# EAGLE design base (EAGLE 9.3.2)

## Sheet 1 of 4
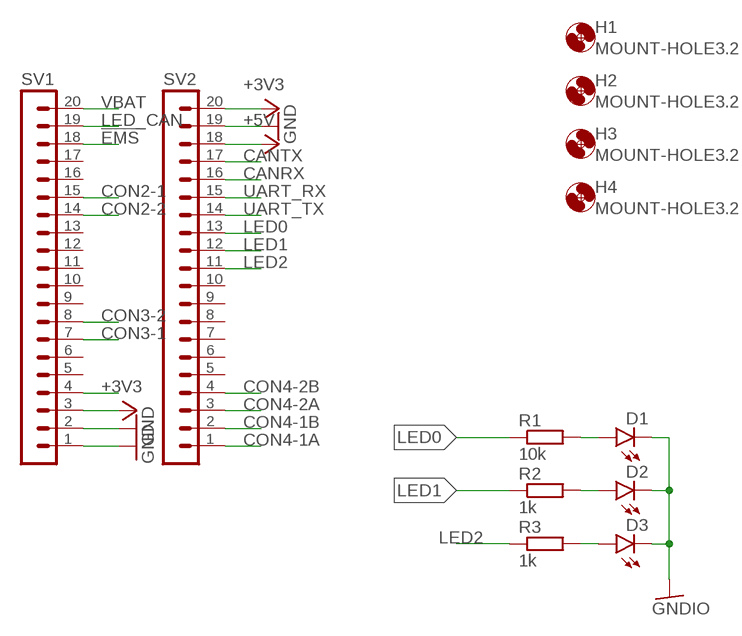
[diagram p0: schematic, sheet 1]

### Parts
D1  LEDCHIPLED_0805  [CHIPLED_0805]
D2  LEDCHIPLED_0805  [CHIPLED_0805]
D3  LEDCHIPLED_0805  [CHIPLED_0805]
H1  MOUNT-HOLE3.2  [3,2]
H2  MOUNT-HOLE3.2  [3,2]
H3  MOUNT-HOLE3.2  [3,2]
H4  MOUNT-HOLE3.2  [3,2]
R1  10k  R-EU_R0603  [R0603]
R2  1k  R-EU_R0603  [R0603]
R3  1k  R-EU_R0603  [R0603]
SV1  MA20-1L  [MA20-1L]
SV2  MA20-1L  [MA20-1L]

### Nets
!EMS: SV1.18 ; also sheet 2
+3V3: SV1.3 SV2.20 ; also sheet 3,4
+5V: SV2.18 ; also sheet 2,3,4
CANRX: SV2.16 ; also sheet 2
CANTX: SV2.17 ; also sheet 2
CON2-1: SV1.15 ; also sheet 4
CON2-2: SV1.14 ; also sheet 4
CON3-1: SV1.7 ; also sheet 4
CON3-2: SV1.8 ; also sheet 4
CON4-1A: SV2.1 ; also sheet 4
CON4-1B: SV2.2 ; also sheet 4
CON4-2A: SV2.3 ; also sheet 4
CON4-2B: SV2.4 ; also sheet 4
GND: D1.C D2.C D3.C SV1.1 SV1.2 SV2.19 ; supply symbol labelled GNDIO ; also sheet 2,3,4
LED0: R1.1 SV2.13
LED1: R2.1 SV2.12
LED2: R3.1 SV2.11
LED_CAN: SV1.19 ; also sheet 2
N$3: D2.A R2.2
N$7: D1.A R1.2
N$10: D3.A R3.2
N$33: SV1.4
UART_RX: SV2.15
UART_TX: SV2.14
VBAT: SV1.20
Unconnected: SV1.5 SV1.6 SV1.9 SV1.10 SV1.11 SV1.12 SV1.13 SV1.16 SV1.17 SV2.5 SV2.6 SV2.7 SV2.8 SV2.9 SV2.10

## Sheet 2 of 4
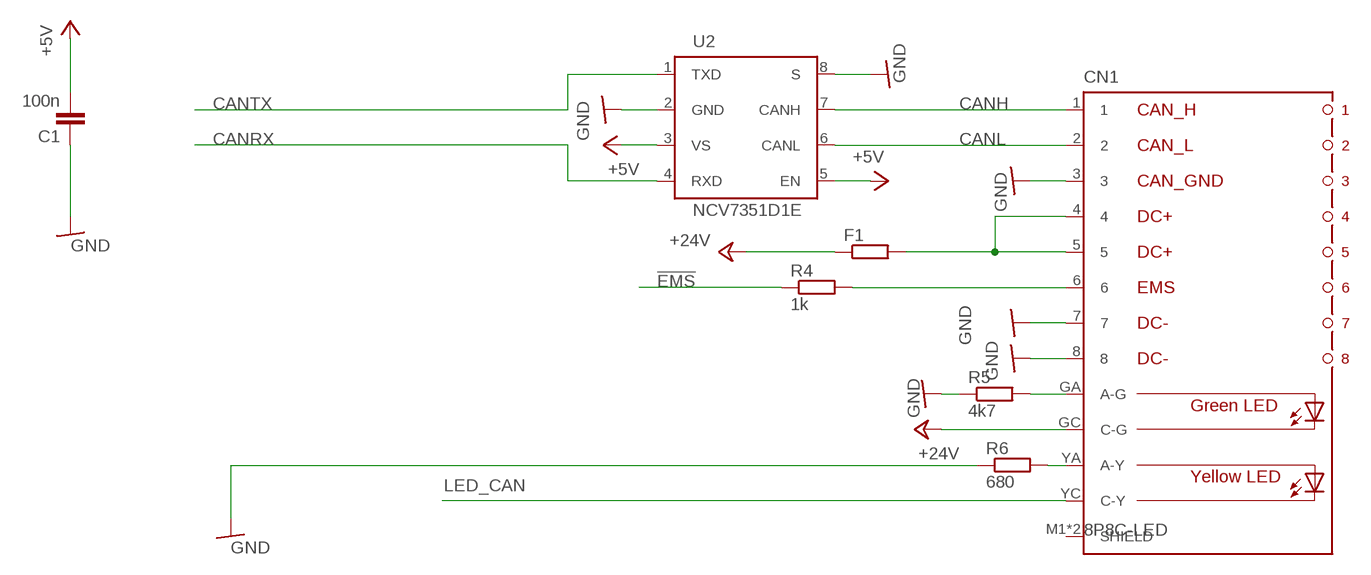
[diagram p1: schematic, sheet 2]

### Parts
C1  100n  C-EUC0603  [C0603]
CN1  8P8C-LED  [8P8C-LED]
F1  R-EU_R1206  [R1206]
R4  1k  R-EU_R0603  [R0603]
R5  4k7  R-EU_R0603  [R0603]
R6  680  R-EU_R0603  [R0603]
U2  NCV7351D1E  [SO08]

### Nets
!EMS: R4.1 ; also sheet 1
!EMS_ISO: CN1.6 R4.2
+5V: C1.2 U2.3(VS) U2.5(EN) ; also sheet 1,3,4
+24V: CN1.GC(C-G) F1.1 ; also sheet 3
CANH: CN1.1 U2.7(CANH)
CANL: CN1.2 U2.6(CANL)
CANRX: U2.4(RXD) ; also sheet 1
CANTX: U2.1(TXD) ; also sheet 1
GND: C1.1 CN1.3 CN1.7 CN1.8 R5.1 R6.1 U2.2(GND) U2.8(S) ; supply symbol labelled GNDIO ; also sheet 1,3,4
LED_CAN: CN1.YC(C-Y) ; also sheet 1
N$6: CN1.GA(A-G) R5.2
N$12: CN1.YA(A-Y) R6.2
N$36: CN1.4 CN1.5 F1.2
Unconnected: CN1.M1(SHIELD) CN1.M2(SHIELD)

## Sheet 3 of 4
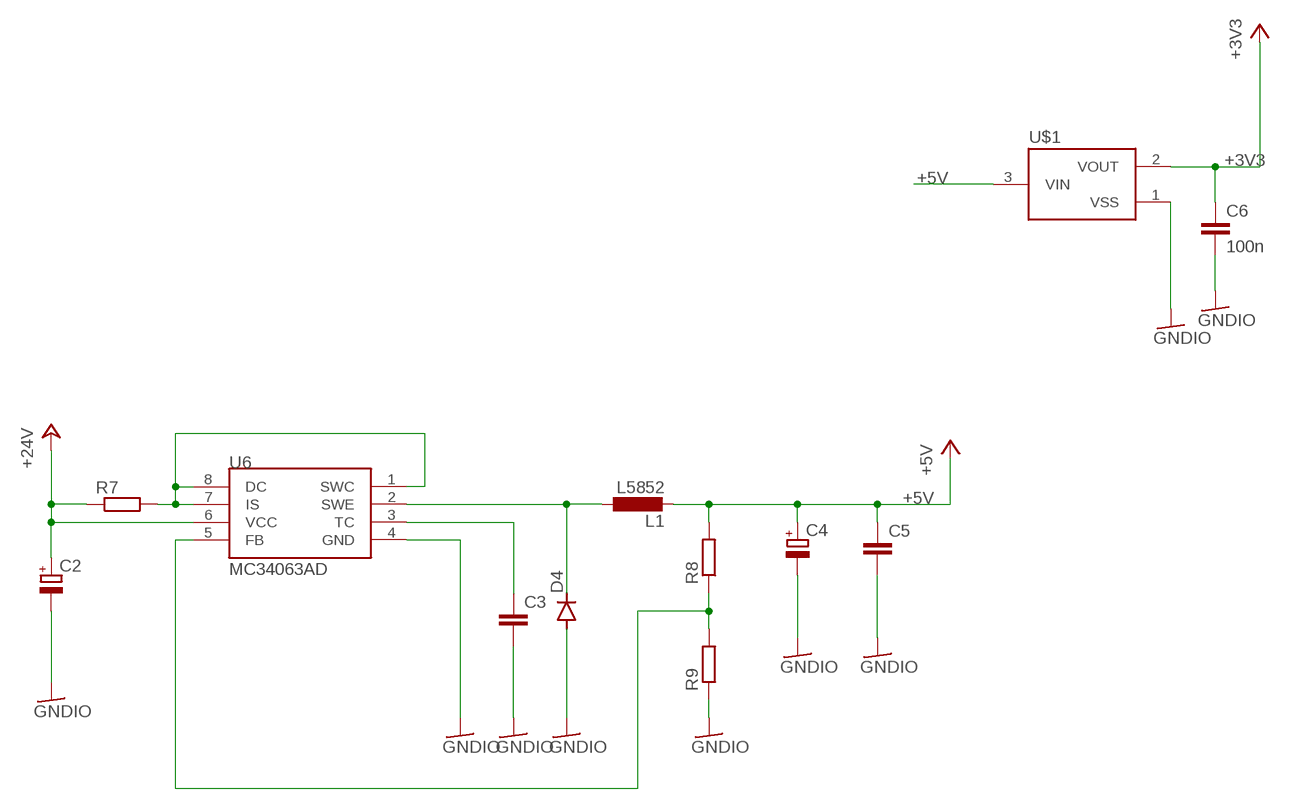
[diagram p2: schematic, sheet 3]

### Parts
C2  CPOL-EUE2-5  [E2-5]
C3  C-EUC0603  [C0603]
C4  CPOL-EUE2-5  [E2-5]
C5  C-EUC0603  [C0603]
C6  100n  C-EUC0603  [C0603]
D4  DIODE-SOD123  [SOD123]
L1  L5852  [L5852]
R7  R-EU_R1206  [R1206]
R8  R-EU_R0603  [R0603]
R9  R-EU_R0603  [R0603]
U6  MC34063AD  [SOIC8]
U$1  XC6206  [SOT95P240X110-3]

### Nets
+3V3: C6.1 U$1.2(VOUT) ; also sheet 1,4
+5V: C4.+ C5.1 L1.P$2 R8.2 U$1.3(VIN) ; also sheet 1,2,4
+24V: C2.+ R7.1 U6.6(VCC) ; also sheet 2
GND: C2.- C3.2 C4.- C5.2 C6.2 D4.A R9.1 U6.4(GND) U$1.1(VSS) ; supply symbol labelled GNDIO ; also sheet 1,2,4
N$58: R7.2 U6.1(SWC) U6.7(IS) U6.8(DC)
N$59: D4.C L1.P$1 U6.2(SWE)
N$60: C3.1 U6.3(TC)
N$61: R8.1 R9.2 U6.5(FB)

## Sheet 4 of 4
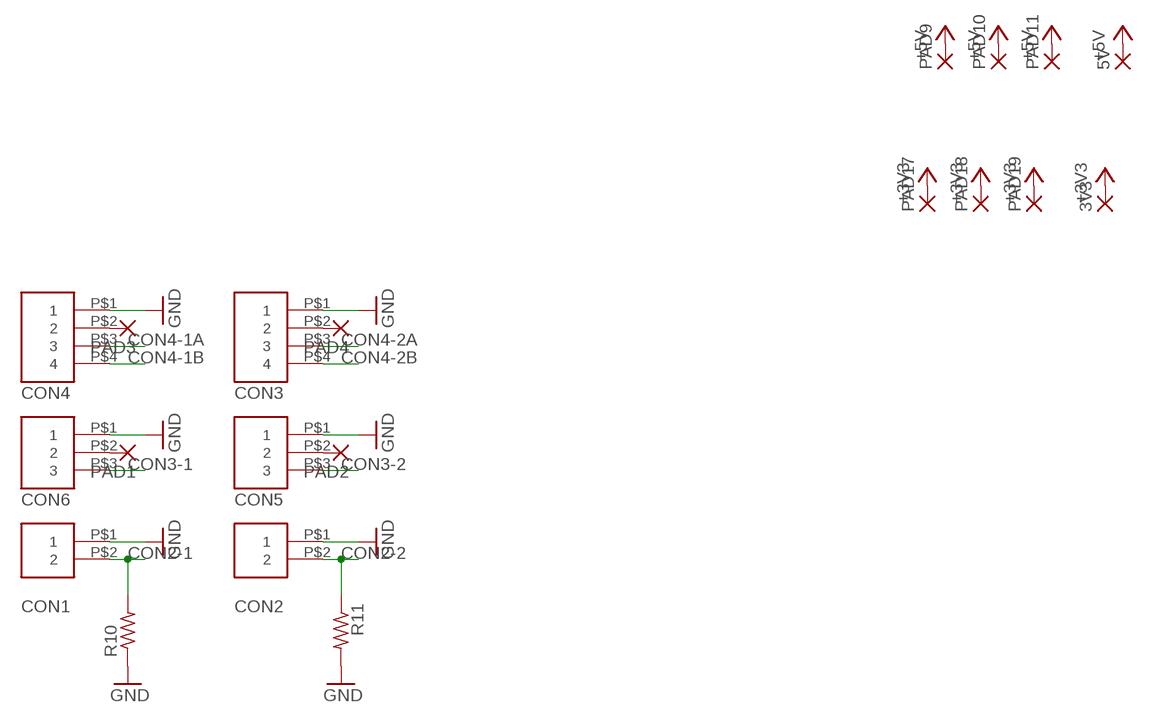
[diagram p3: schematic, sheet 4]

### Parts
3V3  SMD2  [SMD1,27-2,54]
5V  SMD2  [SMD1,27-2,54]
CON1  XH-2-SIDE  [CON-XH-2-SIDE]
CON2  XH-2-SIDE  [CON-XH-2-SIDE]
CON3  XH-4-SIDE  [CON-XH-4-SIDE]
CON4  XH-4-SIDE  [CON-XH-4-SIDE]
CON5  XH-3-SIDE  [CON-XH-3-SIDE]
CON6  XH-3-SIDE  [CON-XH-3-SIDE]
PAD1  SMD2  [SMD1,27-2,54]
PAD2  SMD2  [SMD1,27-2,54]
PAD3  SMD2  [SMD1,27-2,54]
PAD4  SMD2  [SMD1,27-2,54]
PAD9  SMD2  [SMD1,27-2,54]
PAD10  SMD2  [SMD1,27-2,54]
PAD11  SMD2  [SMD1,27-2,54]
PAD17  SMD2  [SMD1,27-2,54]
PAD18  SMD2  [SMD1,27-2,54]
PAD19  SMD2  [SMD1,27-2,54]
R10  R-US_R0603  [R0603]
R11  R-US_R0603  [R0603]

### Nets
+3V3: 3V3.1(P) PAD17.1(P) PAD18.1(P) PAD19.1(P) ; also sheet 1,3
+5V: 5V.1(P) PAD9.1(P) PAD10.1(P) PAD11.1(P) ; also sheet 1,2,3
CON2-1: CON1.P$2 R10.2 ; also sheet 1
CON2-2: CON2.P$2 R11.1 ; also sheet 1
CON3-1: CON6.P$3 ; also sheet 1
CON3-2: CON5.P$3 ; also sheet 1
CON4-1A: CON4.P$3 ; also sheet 1
CON4-1B: CON4.P$4 ; also sheet 1
CON4-2A: CON3.P$3 ; also sheet 1
CON4-2B: CON3.P$4 ; also sheet 1
GND: CON1.P$1 CON2.P$1 CON3.P$1 CON4.P$1 CON5.P$1 CON6.P$1 R10.1 R11.2 ; also sheet 1,2,3
N$1: CON3.P$2 PAD4.1(P)
N$2: CON5.P$2 PAD2.1(P)
N$4: CON4.P$2 PAD3.1(P)
N$11: CON6.P$2 PAD1.1(P)

## Library data of the parts
3V3 5V PAD1-PAD4 PAD9-PAD11 PAD17-PAD19 = wirepad:SMD2: SMD PAD
C1 C5 C6 = rcl:C-EU: CAPACITOR, European symbol
C2 C4 = rcl:CPOL-EU: POLARIZED CAPACITOR, European symbol
C3 = rcl:C-EU: CAPACITOR, European symbol; SPICEPREFIX: C
CN1 = con-rj45:8P8C-LED: generic 8P8C connector with two LED's; OC_FARNELL: unknown; OC_NEWARK: unknown
CON1 CON2 = con-xh:XH-2-SIDE
CON3 CON4 = con-xh:XH-4-SIDE
CON5 CON6 = con-xh:XH-3-SIDE
D1-D3 = led:LED: LED OSRAM: - CHIPLED LG R971, LG N971, LY N971, LG Q971, LY Q971, LO R971, LY R971 LH N974, LH R974 LS Q976, LO Q976, LY Q976 LO Q996 - Hyper CHIPLED LW Q18S LB Q993, LB Q99A, LB R99A - SideLED LS A670, LO A670, LY A670, LG A670, LP A670 LB A673, LV A673, LT A673, LW A673 LH A674 LY A675 LS A676, LA A676, LO A676, LY A676, LW A676 LS A679, LY A679, LG A679 - Hyper Micro SIDELED® LS Y876, LA Y876, LO Y876, LY Y876 LT Y87S - SmartLED LW L88C, LW L88S LB L89C, LB L89S, LG L890 LS L89K, LO L89K, LY L89K LS L896, LA L896, LO L896, LY L896 - TOPLED LS T670, LO T670, LY T670, LG T670, LP T670 LSG T670, LSP T670, LSY T670, LOP T670, LYG T670 LG T671, LOG T671, LSG T671 LB T673, LV T673, LT T673, LW T673 LH T674 LS T676, LA T676, LO T676, LY T676, LB T676, LH T676, LSB T676, LW T676 LB T67C, LV T67C, LT T67C, LS T67K, LO T67K, LY T67K, LW E67C LS E67B, LA E67B, LO E67B, LY E67B, LB E67C, LV E67C, LT E67C LW T67C LS T679, LY T679, LG T679 LS T770, LO T770, LY T770, LG T770, LP T770 LB T773, LV T773, LT T773, LW T773 LH T774 LS E675, LA E675, LY E675, LS T675 LS T776, LA T776, LO T776, LY T776, LB T776 LHGB T686 LT T68C, LB T68C - Hyper Mini TOPLED® LB M676 - Mini TOPLED Santana® LG M470 LS M47K, LO M47K, LY M47K Source: http://www.osram.convergy.de LUXEON: - LUMILED® LXK2-PW12-R00, LXK2-PW12-S00, LXK2-PW14-U00, LXK2-PW14-V00 LXK2-PM12-R00, LXK2-PM12-S00, LXK2-PM14-U00 LXK2-PE12-Q00, LXK2-PE12-R00, LXK2-PE12-S00, LXK2-PE14-T00, LXK2-PE14-U00 LXK2-PB12-K00, LXK2-PB12-L00, LXK2-PB12-M00, LXK2-PB14-N00, LXK2-PB14-P00, LXK2-PB14-Q00 LXK2-PR12-L00, LXK2-PR12-M00, LXK2-PR14-Q00, LXK2-PR14-R00 LXK2-PD12-Q00, LXK2-PD12-R00, LXK2-PD12-S00 LXK2-PH12-R00, LXK2-PH12-S00 LXK2-PL12-P00, LXK2-PL12-Q00, LXK2-PL12-R00 Source: www.luxeon.com KINGBRIGHT: KA-3528ASYC Source: www.kingbright.com
D4 = diode:DIODE-: DIODE
F1 R4-R9 = rcl:R-EU_: RESISTOR, European symbol; SPICEPREFIX: R
H1-H4 = holes:MOUNT-HOLE: MOUNTING HOLE with drill center marker
L1 = l_ysk:L5852
R1-R3 = rcl:R-EU_: RESISTOR, European symbol
R10 R11 = rcl:R-US_: RESISTOR, American symbol; SPICEPREFIX: R
SV1 SV2 = con-lstb:MA20-1L: PIN HEADER; OC_FARNELL: unknown; OC_NEWARK: unknown
U2 = on-semi:NCV7351D1E: High Speed CAN Transceiver Source: NCV7351-D.PDF <http://www.onsemi.com/PowerSolutions/document/NCV7351-D.PDF>
U6 = mc34063:MC34063
U$1 = torex:XC6206

## Board
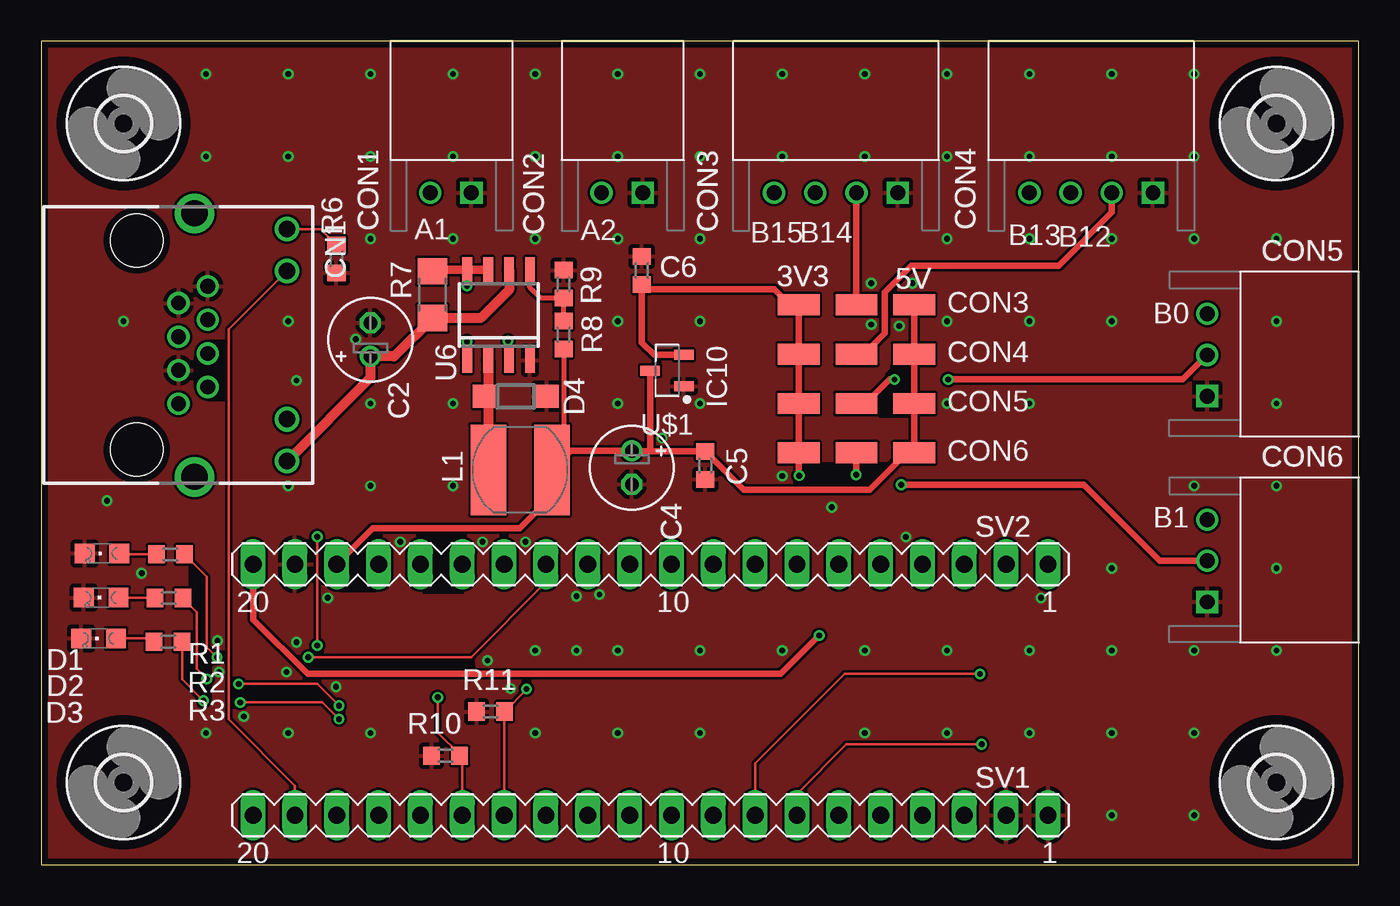
[diagram p4: board, top side]
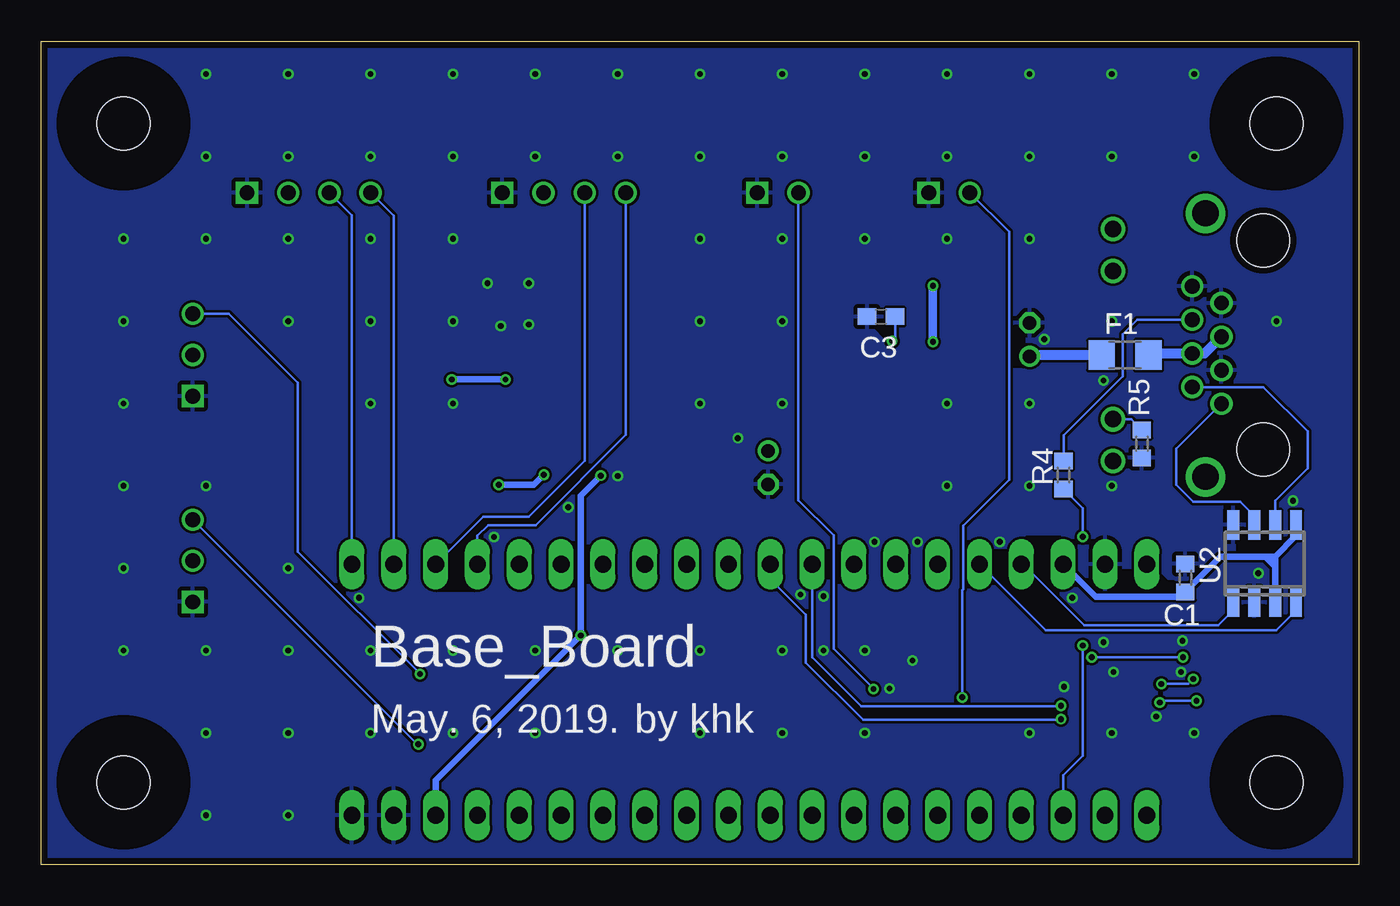
[diagram p5: board, bottom side, seen from below]

Size 80 x 50 mm. Coordinates in mm from the lower left corner, seen from the top.
Outline: 0,0 80,0 80,50 0,50 0,0
Copper layers (1*16): Top 0.035mm / dielectric 1.5mm / Bottom 0.035mm
Design rules "seeed_2layers": minimum track width 6mil, minimum drill 0.2mm, track to track 6mil, track to pad 6mil, pad to pad 6mil, via to via 6mil, smd to smd 0mil, copper to edge 0.4mm, drill to drill 12mil, minimum pad ring 0.15mm, minimum via ring 0.15mm, stop-mask expansion 4mil, vias tented up to drill 50mil, thermal gap 10mil

### Footprints (pad centres in the part's own frame; a part is rotated, then mirrored left to right if it is on the bottom)
SMD1,27-2,54 = smd 1.27 x 2.54: 1 0,0
C0603 = smd 1 x 1.1: 1 -0.85,0; 2 0.85,0
E2-5 = drill 0.813 pad 1.27: + -1.016,0 | drill 0.813 pad 1.27 octagon: - 1.016,0
C0603' = smd 1.1 x 1: 1 -0.85,0; 2 0.85,0
8P8C-LED = drill 0.9 pad 1.3: 1 3.57,-3.81; 2 2.55,-2.03; 3 1.53,-3.81; 4 0.51,-2.03; 5 -0.51,-3.81; 6 -1.53,-2.03; 7 -2.55,-3.81; 8 -3.57,-2.03 | drill 1 pad 1.422: GA 4.5,2.78; GC 7.04,2.78; YA -7.04,2.78; YC -4.5,2.78 | drill 1.6 pad 2.184: M1 -8,-2.85; M2 8,-2.85 | hole 3.2: 6.35,-6.35; -6.35,-6.35
CON-XH-2-SIDE = drill 0.9 square: P$1 4.92,2.3 | drill 0.9: P$2 2.42,2.3
CON-XH-4-SIDE = drill 0.9 square: P$1 10,2.3 | drill 0.9: P$2 7.5,2.3; P$3 5,2.3; P$4 2.5,2.3
CON-XH-3-SIDE = drill 0.9 square: P$1 7.55,2.3 | drill 0.9: P$2 5.05,2.3; P$3 2.55,2.3
CHIPLED_0805 = smd 1.2 x 1.2: A 0,-1.05; C 0,1.05
SOD123 = smd 1.4 x 1.4: A 1.9,0; C -1.9,0
R1206 = smd 1.6 x 1.803: 1 -1.422,0; 2 1.422,0
3,2 = hole 3.2: 0,0
L5852 = smd 2.15 x 5.5: P$1 1.925,0; P$2 -1.925,0
R0603 = smd 1 x 1.1: 1 -0.85,0; 2 0.85,0
MA20-1L = drill 1.016 long: 1 24.13,0; 2 21.59,0; 3 19.05,0; 4 16.51,0; 5 13.97,0; 6 11.43,0; 7 8.89,0; 8 6.35,0; 9 3.81,0; 10 1.27,0; 11 -1.27,0; 12 -3.81,0; 13 -6.35,0; 14 -8.89,0; 15 -11.43,0; 16 -13.97,0; 17 -16.51,0; 18 -19.05,0; 19 -21.59,0; 20 -24.13,0
SO08 = smd 0.72 x 1.78: 1 -1.905,-2.35; 2 -0.635,-2.35; 3 0.635,-2.35; 4 1.905,-2.35; 5 1.905,2.35; 6 0.635,2.35; 7 -0.635,2.35; 8 -1.905,2.35
SOIC8 = smd 0.6 x 1.5: 1 -1.905,-2.75; 2 -0.635,-2.75; 3 0.635,-2.75; 4 1.905,-2.75; 5 1.905,2.75; 6 0.635,2.75; 7 -0.635,2.75; 8 -1.905,2.75
SOT95P240X110-3 = smd 1.18 x 0.609: 1 -1.024,0.95; 2 -1.024,-0.95; 3 1.024,0

### Placement (x,y rotation side)
3V3  46,34 270 top
5V  53,34 270 top
C1  10.53,17.42 270 bottom
C2  19.99,31.88 90 top
C3  [C0603']  29.01,33.28 180 bottom
C4  35.86,24.11 270 top
C5  40.32,24.24 270 top
C6  36.47,36.08 90 top
CN1  12.15,31.55 270 top
CON1  21.2,38.5 0 top
CON2  31.6,38.5 0 top
CON3  42,38.5 0 top
CON4  57.5,38.5 0 top
CON5  68.5,36 270 top
CON6  68.5,23.5 270 top
D1  3.69,18.9 90 top
D2  3.64,16.22 90 top
D3  3.49,13.74 90 top
D4  28.81,28.44 0 top
F1  14.19,30.94 0 bottom
H1  5,5 0 top
H2  75,5 0 top
H3  5,45 0 top
H4  75,45 0 top
L1  29.08,23.97 180 top
PAD1  49.5,25 270 top
PAD2  49.5,28 270 top
PAD3  49.5,31 270 top
PAD4  49.5,34 270 top
PAD9  53,25 270 top
PAD10  53,28 270 top
PAD11  53,31 270 top
PAD17  46,25 270 top
PAD18  46,28 270 top
PAD19  46,31 270 top
R1  7.84,18.84 180 top
R2  7.75,16.19 180 top
R3  7.71,13.54 180 top
R4  17.93,23.66 90 bottom
R5  13.17,25.55 90 bottom
R6  17.93,36.78 90 top
R7  23.76,34.61 90 top
R8  31.72,32.17 270 top
R9  31.72,35.25 270 top
R10  24.56,6.61 0 top
R11  27.29,9.3 180 top
SV1  37,3 0 top
SV2  37,18.24 0 top
U2  5.72,18.28 0 bottom
U6  27.77,33.38 0 top
U$1  38,30 180 top

### Tracks (layer width: path | path; a pad name or v marks a point on that pad's centre or on a via)
!EMS  (via drill 0.35)
  Top 0.152: v16.76,19.91 v16.76,13.31
  Bottom 0.152: R4.1 16.76,21.64 v16.76,19.91 | v16.76,13.31 16.76,6.6 17.95,5.42 SV1.18
!EMS_ISO
  Bottom 0.152: R4.2 17.93,26.06 14.33,29.67 14.33,32.21 13.45,33.08 CN1.6
+3V3  (via drill 0.35)
  Top 0.406: v46.02,23.62 46,23.65 PAD17.1 PAD18.1 PAD19.1 3V3.1 45.45,34 44.5,34.95 36.75,34.95 C6.1 36.47,31.7 37.22,30.95 U$1.2 | SV2.20 12.87,14.89 16.18,11.58 44.91,11.58 v47.24,13.92
  Bottom 0.406: v46.02,23.62 47.24,22.4 v47.24,13.92 56.05,5.11 SV1.3
+5V
  Top 0.305: R8.2 31.72,25.38 31.8,25.3 31.8,24.77 L1.P$2
  Top 0.406: 5V.1 PAD11.1 PAD10.1 PAD9.1 52.43,25 52.12,24.69 52.12,24.59 50.29,22.76 42.65,22.76 C5.1 36.98,25.09 | 36.98,25.09 35.9,25.09 C4.+ 32.16,25.13 L1.P$2 31,22.37 29.06,20.42 20.13,20.42 SV2.18 | U$1.3 36.98,25.1 36.98,25.09
  Bottom 0.406: SV2.18 15.97,16.26 10.84,16.26 C1.2 8.41,18.69 5.7,18.69 | 5.08,18.69 3.81,19.96 U2.5 | 5.7,18.69 5.08,18.69 | 5.08,18.69 5.08,18.09 | 5.08,18.09 U2.3 | 5.08,18.09 5.7,18.69
+24V
  Top 0.61: U6.6 28.41,34.91 26.69,33.19 R7.1 21.44,30.86 C2.+ 19.99,29.57 CN1.GC
  Bottom 0.61: F1.1 19.91,30.94 C2.+
CANH
  Bottom 0.152: U2.7 6.36,21.19 7.21,22.05 10.06,22.05 11.07,23.06 11.07,25.25 CN1.1
CANL
  Bottom 0.152: U2.6 5.08,22.11 3.11,24.09 3.11,26.32 5.79,29 CN1.2
CANRX
  Bottom 0.152: U2.4 3.81,15.42 5.01,14.22 19.01,14.22 SV2.16
CANTX
  Bottom 0.152: U2.1 7.62,15.44 8.53,14.53 16.66,14.53 20.37,18.24 SV2.17
CON2-1  (via drill 0.35)
  Top 0.152: v24.08,10.16 24.08,8.03 25.41,6.7 R10.2 25.57,6.45 SV1.15
  Bottom 0.152: CON1.P$2 21.23,38.41 21.23,23.37 24.02,20.58 24.02,16.72 24.08,16.66 v24.08,10.16
CON2-2  (via drill 0.35)
  Top 0.152: SV1.14 28.11,9.27 R11.1 29.46,10.62 v29.46,10.67
  Bottom 0.152: CON2.P$2 34.02,22.13 31.89,20.01 31.89,13.1 v29.46,10.67
CON3-1  (via drill 0.35)
  Top 0.152: v57.1,7.32 48.88,7.32 45.89,4.32 SV1.7
  Bottom 0.152: CON6.P$3 57.16,7.32 v57.1,7.32
CON3-2  (via drill 0.35)
  Top 0.152: SV1.8 43.35,6.15 48.78,11.58 v57,11.58
  Bottom 0.152: v57,11.58 64.41,19 64.41,29.26 68.6,33.45 CON5.P$3
CON4-1A
  Bottom 0.152: SV2.1 61.13,39.43 CON4.P$3
CON4-1B
  Bottom 0.152: CON4.P$4 58.59,39.39 SV2.2
CON4-2A
  Bottom 0.152: CON3.P$3 47,24.53 50.39,21.13 53.16,21.13 SV2.3
CON4-2B
  Bottom 0.152: CON3.P$4 44.5,26.11 49.99,20.62 52.85,20.62 53.51,19.97 SV2.4
GND  (via drill 0.35)
  other vias: 10,48 15,48 10,43 15,43 30,48 35,48 30,43 35,43 20,48 25,48 20,43 25,43 40,48 45,48 40,43 45,43 50,48 50,43 55,48 60,48 55,43 60,43 65,48 65,43 70,48 70,43 5,33 15,33 20,38 25,38 30,38 35,38 35,33 35,28 25,28 20,28 40,28 40,33 40,38 55,38 55,33 60,33 60,38 65,38 65,33 55,28 60,28 70,38 75,38 75,28 75,33 75,23 70,23 75,18 75,13 25,23 20,23 15,23 30,13 35,13 40,13 45,13 50,13 55,13 60,13 65,13 65,18 70,13 70,8 70,3 65,3 65,8 60,8 55,8 50,8 40,8 35,8 30,8 20,8 15,8 10,8 28.5,10.7 14.9,11.7 10.7,13.6 10.8,11.7 15.5,13.5 21.8,19.6 26.8,19.6 29.4,19.6 52.9,35.3 52.1,32.7 50.4,32.8 45,23.6 50.4,35.3 37.7,25.9 12.3,9 27.1,12.4 17.9,10.8 6.1,17.7 4,22.1 17.4,16.2 19.1,31.9 15.5,29.4 48,21.7 52.5,19.9 33.9,16.4 32.5,16.3 32.5,13 60.7,16.2
  pour Top: 0,0 0,50 80,50 80,0
  pour Bottom: 0,0 0,50 80,50 80,0
  cutout Top: 51.6,30.3 51.6,30.1 51.3,29.8 51.3,28.9 50.9,28.5 50.9,27.2 51.8,27.2 52.7,27.2 52.7,30.3
  cutout Top: 47.4,24.4 51.4,24.4 51.6,24.6 51.6,24.3 50.3,23 46.3,23 46.3,24.4
  cutout Top: 9.3,30.8 9.3,29 10.1,28.2 11.2,28.2 11.2,31.8 10.3,31.8
  cutout Top: 9,18.1 9,16.9 9,16.1 9.9,15.2 9.9,17.5 9.4,18 9.3,18.1
  cutout Top: 10.6,12.3 10.3,12 10.3,10 10,10 8.7,11.3 8.7,12.9 9,13.2 9.7,13.2 9.9,13.2 10.4,12.7 10.6,12.5
  cutout Top: 18.2,16.6 20.3,16.6 20.3,18.7 19.6,19.4 19.4,19.4 18.8,18.8 18.2,18.2
  cutout Top: 23.2,16.5 25.6,16.5 25.6,20.2 23.3,20.2 23.2,20.1
  cutout Top: 26.3,12.1 26.3,12.5 16.8,12.5 16.7,12.5 16.3,12.1 16.3,12 26.3,12
  cutout Bottom: 4.8,14.9 7.9,14.9 8.3,14.5 5.1,14.5 4.8,14.8
  cutout Bottom: 7.4,19.5 7.4,19 5.3,19 4.7,19.6 4.7,19.7 7.4,19.7
  cutout Bottom: 20.3,32.1 20.3,31.6 20.4,31.5 20.4,30.2 21.1,30.2 21.1,32.6 20.8,32.6
  cutout Bottom: 18.1,19.9 20.2,19.9 20.3,19.8 20.3,18.4 18.8,16.9 18.1,17.6
  cutout Bottom: 21.3,19.1 22.3,19.1 22.3,17.8 21.3,16.8
  cutout Bottom: 14.5,17.9 13.7,17.9 13.6,18 13.6,17.1 13.3,16.8 13.3,16.6 15,16.6 15,17.5 14.6,17.9
  cutout Bottom: 11.2,17.2 11.6,17.2 12,17.6 12.4,17.2 12.4,16.6 11.2,16.6
  cutout Bottom: 28.8,32 29.4,32.6 29.3,32.6 29.1,32.8 28.4,32.8 28.4,32.2 28.6,32
  cutout Bottom: 53.7,16.6 56,16.6 56,18.1 54.3,19.8 53.7,19.2
LED0  (via drill 0.35)
  Top 0.152: R1.1 10.06,17.47 10.06,13.21 v10.67,12.6 | v16.21,12.6 26.11,12.6 30.65,17.14 SV2.13
  Bottom 0.152: v10.67,12.6 v16.21,12.6
LED1  (via drill 0.35)
  Top 0.152: v18.09,9.65 16.76,10.97 v11.99,10.97 | R2.1 9.45,15.34 9.45,11.89 v10.06,11.28
  Bottom 0.152: v18.09,9.65 18.13,9.61 30.2,9.61 33.19,12.6 SV2.12 | v11.99,10.97 10.36,10.97 v10.06,11.28
LED2  (via drill 0.35)
  Top 0.152: R3.1 8.56,11.25 v9.86,9.96 | v12.09,9.86 17.07,9.86 v18.09,8.84
  Bottom 0.152: v9.86,9.96 11.99,9.96 v12.09,9.86 | v18.09,8.84 18.13,8.79 30.1,8.79 33.57,12.27 33.57,15.17 35.73,17.33 SV2.11
LED_CAN
  Top 0.152: CN1.YC 11.38,32.5 11.38,8.84 15.41,4.81 SV1.19
N$1
  Top 0.406: PAD4.1 CON3.P$2
N$2  (via drill 0.35)
  Top 0.406: CON5.P$2 69.31,29.46 v55.07,29.46 | v51.82,29.46 51.51,29.46 50.05,28 PAD2.1
  Bottom 0.406: v55.07,29.46 v51.82,29.46
N$3
  Top 0.152: R2.2 6.87,16.22 D2.A
N$4
  Top 0.406: CON4.P$2 65,39.6 61.77,36.37 52.83,36.37 51.21,34.75 51.21,32.26 50.39,31.45 50.39,31.39 50,31 PAD3.1
N$6
  Bottom 0.152: R5.2 13.82,27.05 CN1.GA
N$7
  Top 0.152: R1.2 4.8,18.84 D1.A
N$10
  Top 0.152: R3.2 6.66,13.74 D3.A
N$11  (via drill 0.35)
  Top 0.406: CON6.P$2 67.91,18.45 63.3,23.06 v52.22,23.06 | v49.48,23.67 49.5,23.69 PAD1.1
  Bottom 0.406: v52.22,23.06 50.09,23.06 v49.48,23.67
N$12
  Top 0.152: R6.2 16.97,38.59 CN1.YA
N$36
  Bottom 0.61: F1.2 12.67,31.04 CN1.4 9.36,31.04 CN1.5
N$58  (via drill 0.35)
  Top 0.508: U6.7 U6.8 | U6.8 23.86,36.13 R7.2 | U6.8 25.86,35.16 v25.86,35.15 | v25.86,31.75 U6.1
  Bottom 0.508: v25.86,35.15 v25.86,31.75
N$59
  Top 0.61: U6.2 27.14,28.66 D4.C 27.16,28.2 L1.P$1
N$60  (via drill 0.35)
  Top 0.152: v28.35,31.8 28.41,31.74 U6.3
  Bottom 0.152: C3.1 28.16,31.99 v28.35,31.8
N$61
  Top 0.305: R8.1 R9.2 30.32,34.4 29.68,35.04 U6.5

### Text on the board
tNames: A1 | A2 | B15 | B14 | B13 | B12 | CON3 | B0 | CON4 | CON5 | CON6 | B1
bNames: Base_Board | by khk | May. 6, 2019.
_tNames: CN1 | CON4 | R6 | CON1 | CON2 | CON3 | CON5 | R9 | C6 | 3V3 | 5V | R7 | R8 | U6 | IC10 | D4 | C2 | C5 | CON6 | L1 | C4 | SV2 | D1 | R1 | D2 | R2 | R11 | D3 | R3 | R10 | SV1
_bNames: F1 | C3 | R5 | R4 | U2 | C1